# EAGLE design plug-v24-Make-board-myself-to-test-circuit (EAGLE 7.6.0)
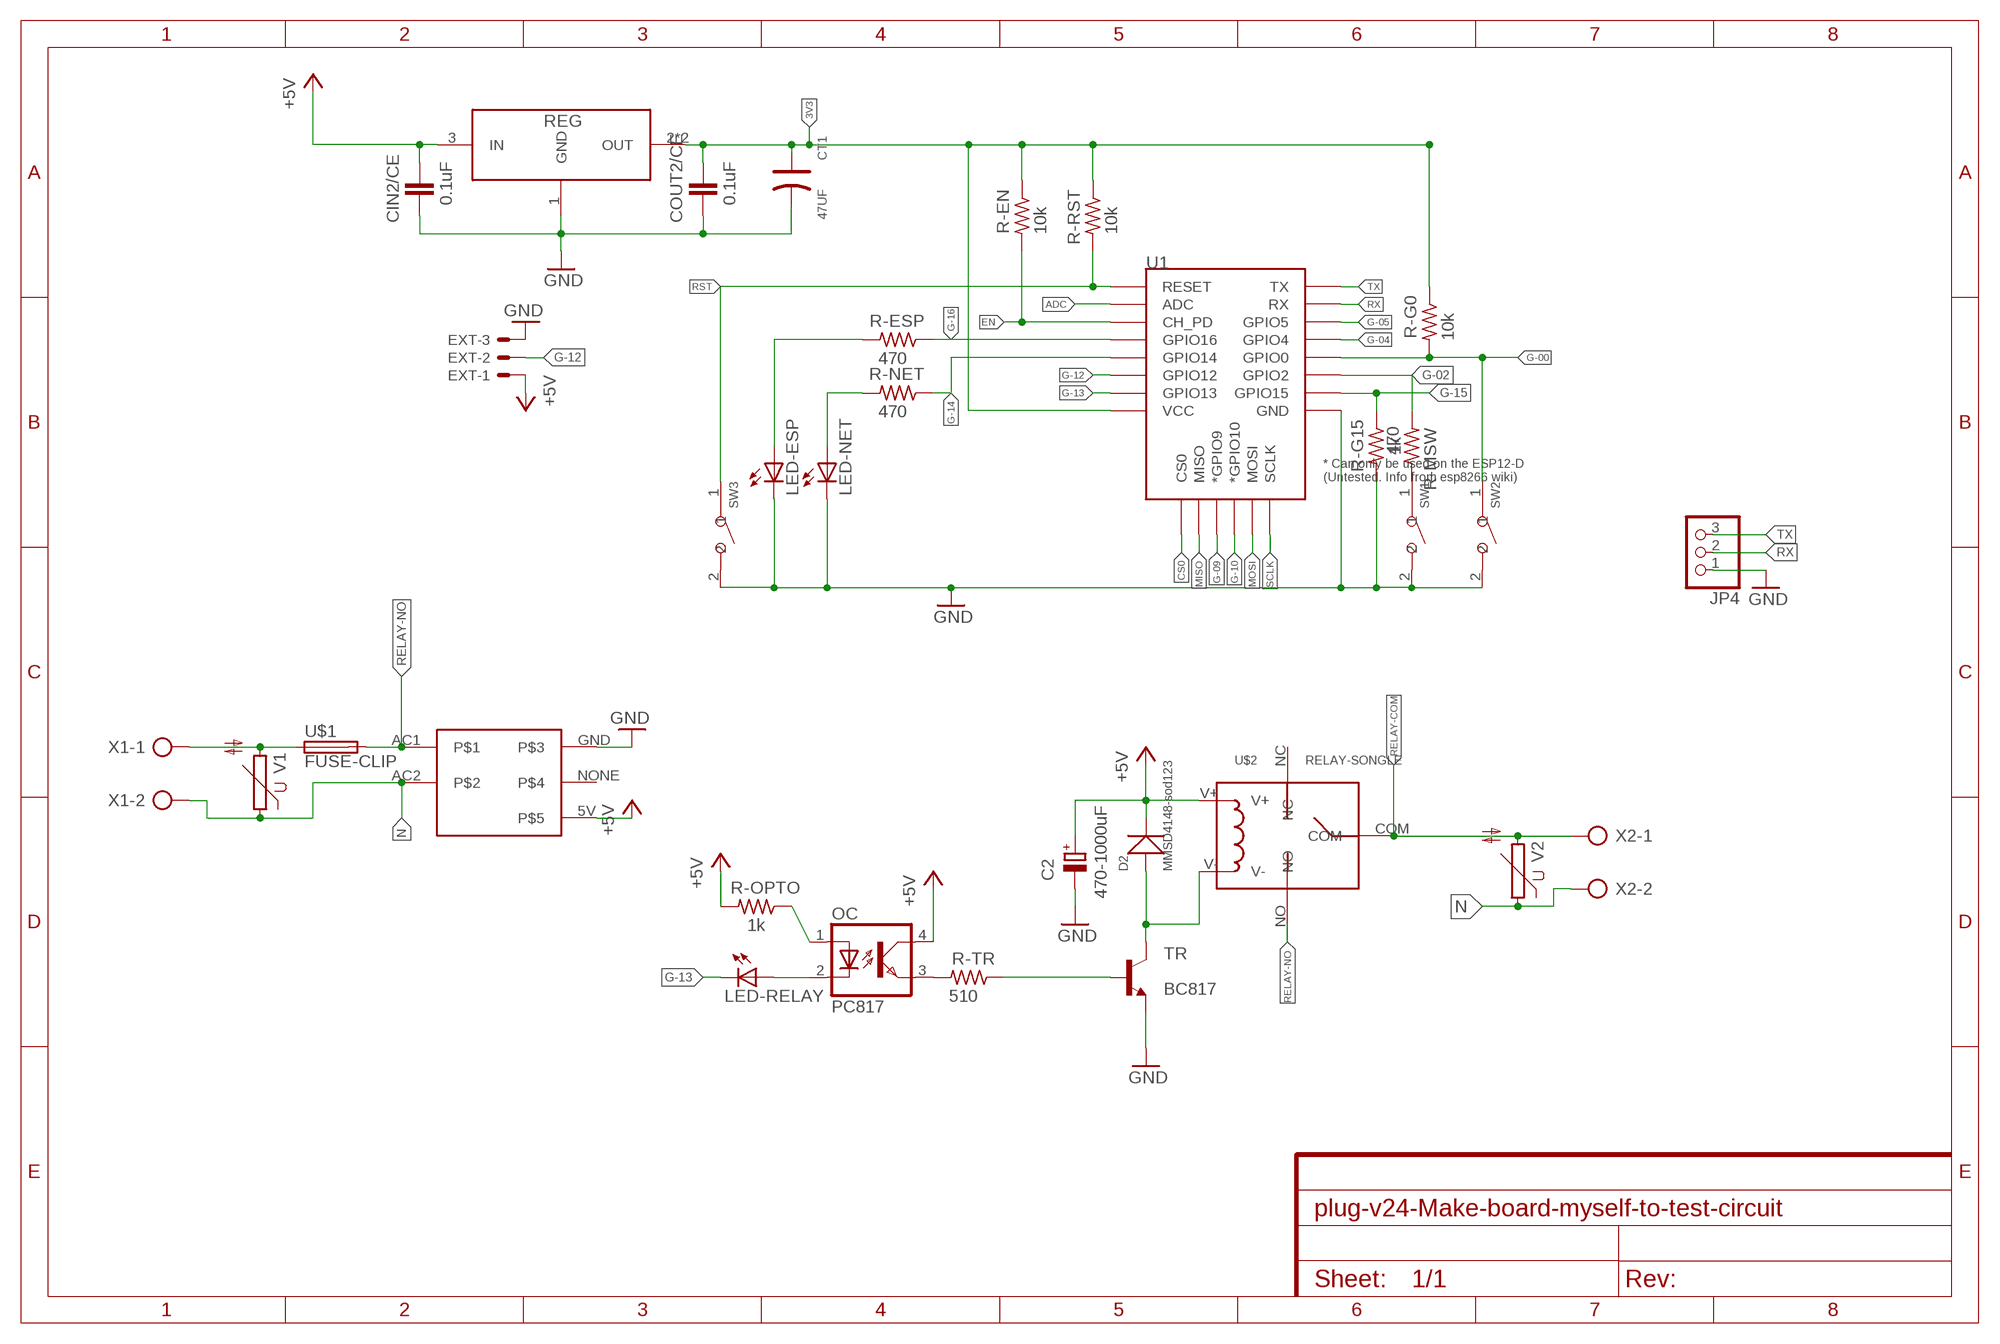
[diagram p0: schematic, sheet 1]

## Parts
C2  470-1000uF  CPOL-EUE3.5-8  [E3,5-8]
CIN2/CE  0.1uF  C-EUC0805K  [C0805K]
COUT2/CE  0.1uF  C-EUC0805K  [C0805K]
CT1  47UF  ALUMINUM-SMD-47UF-25V(D6.3-H5.3MM)  [ELECTRO-SMD-C-6MM]
D2  MMSD4148-sod123  SMD-DIODE-100V-200MA(SOD-123)  [SOD-123]
EXT  53048-03  [53048-03]
JP4  PINHD-1X3  [1X03]
LED-ESP  LEDCHIPLED_0805  [CHIPLED_0805]
LED-NET  LEDCHIPLED_0805  [CHIPLED_0805]
LED-RELAY  LEDCHIPLED_0805  [CHIPLED_0805]
OC  PC817  [DIL04]
R-EN  10k  R-US_M0805  [M0805]
R-ESP  470  R-US_M0805  [M0805]
R-G0  10k  R-US_M0805  [M0805]
R-G15  1k  R-US_M0805  [M0805]
R-MSW  470  R-US_M0805  [M0805]
R-NET  470  R-US_M0805  [M0805]
R-OPTO  1k  R-US_M0805  [M0805]
R-RST  10k  R-US_M0805  [M0805]
R-TR  510  R-US_M0805  [M0805]
REG  AMS1117-3.3  [SOT-223]
SW1  DIP-BUTTON(2P-6.0X3.0X4.3MM)-TS-1101F  [SW2-5.0-6.0X3.0X4.3MM]
SW2  DIP-BUTTON(2P-6.0X3.0X4.3MM)-TS-1101F  [SW2-5.0-6.0X3.0X4.3MM]
SW3  DIP-BUTTON(2P-6.0X3.0X4.3MM)-TS-1101F  [SW2-5.0-6.0X3.0X4.3MM]
TR  BC817  BC817-16SMD  [SOT23-BEC]
U1  ESP12ESMD  [ESP12E-SMD]
U$1  FUSE-CLIP  [FUSE-CLIP]
U$2  RELAY-SONGLE  [RELAY-SONGLE]
U$4  POWERSUPPLY-5V-700MA  [POWERSUPPLY-5V-700MA]
V1  S14K11  [S14K11]
V2  S14K11  [S14K11]
X1  AK300/2  [AK300/2]
X2  AK300/2  [AK300/2]

## Nets
3V3: COUT2/CE.1 CT1.+ R-EN.1 R-G0.1 R-RST.1 REG.2(OUT) REG.4(OUT) U1.VCC
+5V: C2.+ CIN2/CE.1 D2.- EXT.1 OC.4(COL) R-OPTO.2 REG.3(IN) U$2.V+ U$4.5V
ADC: U1.ADC
CS0: U1.CS0
EN: R-EN.2 U1.CH_PD
G-00: R-G0.2 SW2.1 U1.GPIO0
G-02: R-MSW.2 U1.GPIO2
G-04: U1.GPIO4
G-05: U1.GPIO5
G-09: U1.GPIO9(*GPIO9)
G-10: U1.GPIO10(*GPIO10)
G-12: EXT.2 U1.GPIO12
G-13: LED-RELAY.C U1.GPIO13
G-14: R-NET.1 U1.GPIO14
G-15: R-G15.1 U1.GPIO15
G-16: R-ESP.1 U1.GPIO16
GND: C2.- CIN2/CE.2 COUT2/CE.2 CT1.- EXT.3 JP4.1 LED-ESP.C LED-NET.C R-G15.2 REG.1(GND) SW1.2 SW2.2 SW3.2 TR.E U1.GND U$4.GND
LINE: U$1.3 U$1.4 V1.2 X1.1
MISO: U1.MISO
MOSI: U1.MOSI
N: U$4.AC2 V1.1 V2.1 X1.2 X2.2
N$1: OC.3(EMIT) R-TR.2
N$2: R-TR.1 TR.B
N$6: LED-ESP.A R-ESP.2
N$13: OC.1(A) R-OPTO.1
N$16: LED-NET.A R-NET.2
N$17: D2.+ TR.C U$2.V-
N$21: LED-RELAY.A OC.2(C)
N$22: R-MSW.1 SW1.1
RELAY-COM: U$2.COM V2.2 X2.1
RELAY-NO: U$1.5 U$1.6 U$2.NO U$4.AC1
RST: R-RST.2 SW3.1 U1.RESET
RX: JP4.2 U1.RXD0(RX)
SCLK: U1.SCLK
TX: JP4.3 U1.TXD0(TX)
Unconnected: U$2.NC U$4.NONE

## Library data of the parts
C2 = rcl:CPOL-EU: POLARIZED CAPACITOR, European symbol
CIN2/CE COUT2/CE = rcl:C-EU: CAPACITOR, European symbol
CT1 = Seeed-OPL-Capacitor:ALUMINUM-SMD-47UF-25V(D6.3-H5.3MM): 302030059; MPN: CS1E470M-CRE54
D2 = Seeed-OPL-Diode:SMD-DIODE-100V-200MA(SOD-123): 304010007; MPN: MMSD4148
EXT = con-molex:53?-03: CONNECTOR wire to board 1.25 mm (.049 inch) pitch header; MF: WALDOM/MOLEX; MPN: 53048-0310; OC_FARNELL: 9732918; OC_NEWARK: 38C9908
JP4 = pinhead:PINHD-1X3: PIN HEADER
LED-ESP LED-NET LED-RELAY = led:LED: LED OSRAM: - CHIPLED LG R971, LG N971, LY N971, LG Q971, LY Q971, LO R971, LY R971 LH N974, LH R974 LS Q976, LO Q976, LY Q976 LO Q996 - Hyper CHIPLED LW Q18S LB Q993, LB Q99A, LB R99A - SideLED LS A670, LO A670, LY A670, LG A670, LP A670 LB A673, LV A673, LT A673, LW A673 LH A674 LY A675 LS A676, LA A676, LO A676, LY A676, LW A676 LS A679, LY A679, LG A679 - Hyper Micro SIDELED® LS Y876, LA Y876, LO Y876, LY Y876 LT Y87S - SmartLED LW L88C, LW L88S LB L89C, LB L89S, LG L890 LS L89K, LO L89K, LY L89K LS L896, LA L896, LO L896, LY L896 - TOPLED LS T670, LO T670, LY T670, LG T670, LP T670 LSG T670, LSP T670, LSY T670, LOP T670, LYG T670 LG T671, LOG T671, LSG T671 LB T673, LV T673, LT T673, LW T673 LH T674 LS T676, LA T676, LO T676, LY T676, LB T676, LH T676, LSB T676, LW T676 LB T67C, LV T67C, LT T67C, LS T67K, LO T67K, LY T67K, LW E67C LS E67B, LA E67B, LO E67B, LY E67B, LB E67C, LV E67C, LT E67C LW T67C LS T679, LY T679, LG T679 LS T770, LO T770, LY T770, LG T770, LP T770 LB T773, LV T773, LT T773, LW T773 LH T774 LS E675, LA E675, LY E675, LS T675 LS T776, LA T776, LO T776, LY T776, LB T776 LHGB T686 LT T68C, LB T68C - Hyper Mini TOPLED® LB M676 - Mini TOPLED Santana® LG M470 LS M47K, LO M47K, LY M47K Source: http://www.osram.convergy.de LUXEON: - LUMILED® LXK2-PW12-R00, LXK2-PW12-S00, LXK2-PW14-U00, LXK2-PW14-V00 LXK2-PM12-R00, LXK2-PM12-S00, LXK2-PM14-U00 LXK2-PE12-Q00, LXK2-PE12-R00, LXK2-PE12-S00, LXK2-PE14-T00, LXK2-PE14-U00 LXK2-PB12-K00, LXK2-PB12-L00, LXK2-PB12-M00, LXK2-PB14-N00, LXK2-PB14-P00, LXK2-PB14-Q00 LXK2-PR12-L00, LXK2-PR12-M00, LXK2-PR14-Q00, LXK2-PR14-R00 LXK2-PD12-Q00, LXK2-PD12-R00, LXK2-PD12-S00 LXK2-PH12-R00, LXK2-PH12-S00 LXK2-PL12-P00, LXK2-PL12-Q00, LXK2-PL12-R00 Source: www.luxeon.com KINGBRIGHT: KA-3528ASYC Source: www.kingbright.com
OC = optocoupler:PC817: SHARP OPTO COUPLER; MPN: PC817X4J000F; OC_FARNELL: 9707727; OC_NEWARK: 97K7059
R-EN R-ESP R-G0 R-G15 R-MSW R-NET R-OPTO R-RST R-TR = rcl:R-US_: RESISTOR, American symbol
REG = AMS1117-3.3:AMS1117-3.3: 1A LOW DROPOUT VOLTAGE REGULATOR
SW1-SW3 = Seeed-OPL-Switch:DIP-BUTTON(2P-6.0X3.0X4.3MM): 311020025
TR = transistor-npn:BC817*: NPN Transistor
U1 = esp8266modules:ESP12E: ESP12E Module
U$1 = Fuse-Clip:FUSE-CLIP
U$2 = Relay-Songle:RELAY-SONGLE
U$4 = PowerSupply-5V-700mA:POWERSUPPLY-5V-700MA
V1 V2 = varistor:S14K11: VARISTOR
X1 X2 = con-ptr500:AK300/2: CONNECTOR; OC_FARNELL: unknown; OC_NEWARK: unknown

## Board
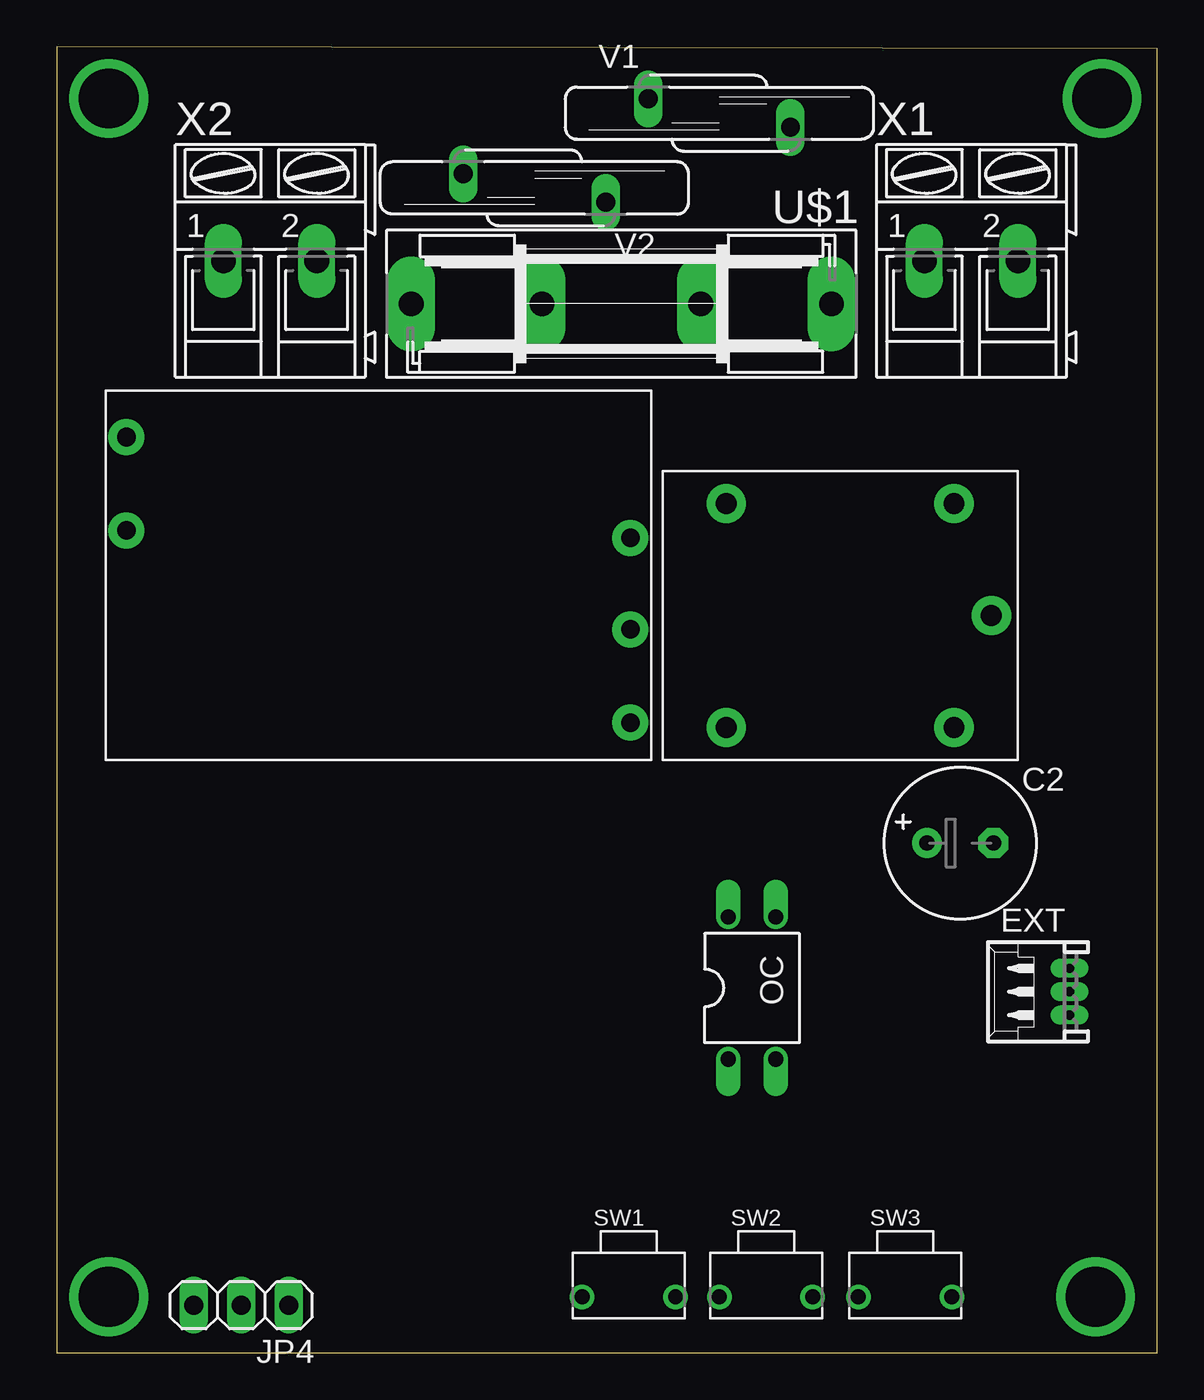
[diagram p1: board, top side]
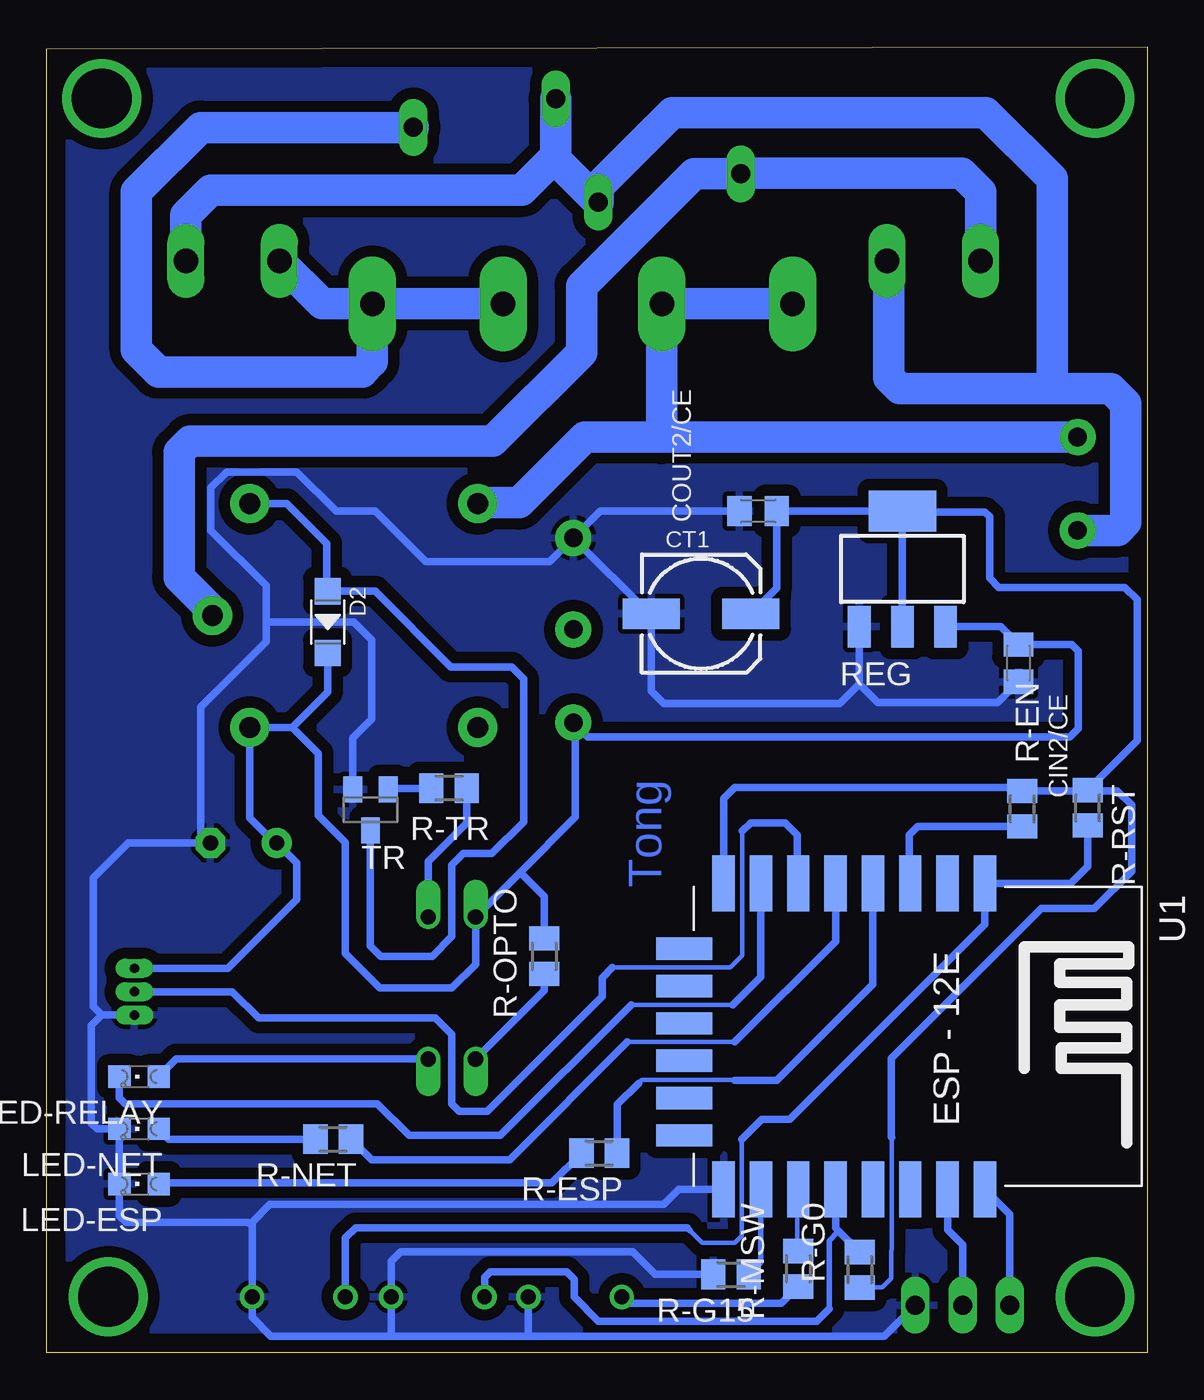
[diagram p2: board, bottom side, seen from below]

Size 58.95 x 69.98 mm. Coordinates in mm from the lower left corner, seen from the top.
Outline: 0,0 58.95,0 58.95,69.88 0,69.98 0,0
Copper layers (1*16): Top 0.035mm / dielectric 1.5mm / Bottom 0.035mm
Design rules "default": minimum track width 10mil, minimum drill 24mil, track to track 8mil, track to pad 8mil, pad to pad 8mil, via to via 8mil, smd to smd 8mil, copper to edge 40mil, drill to drill 8mil, minimum pad ring 10mil, minimum via ring 8mil, stop-mask expansion 4mil, vias tented up to drill 0mil, thermal gap 10mil

### Footprints (pad centres in the part's own frame; a part is rotated, then mirrored left to right if it is on the bottom)
E3,5-8 = drill 0.813 pad 1.6: + -1.778,0 | drill 0.813 pad 1.6 octagon: - 1.778,0
C0805K = smd 1.3 x 1.6: 1 -1,0; 2 1,0
ELECTRO-SMD-C-6MM = smd 3.048 x 1.651: + 2.667,0; - -2.667,0
SOD-123 = smd 1.397 x 1.397: + -1.651,0; - 1.651,0
53048-03 = drill 0.5 pad 0.698 long: 1 1.25,-1.25; 2 0,-1.25; 3 -1.25,-1.25
1X03 = drill 1.016 long: 1 -2.54,0; 2 0,0; 3 2.54,0
CHIPLED_0805 = smd 1.2 x 1.2: A 0,-1.05; C 0,1.05
DIL04 = drill 0.813 offset: 1 -1.27,-3.81; 2 1.27,-3.81; 3 1.27,3.81; 4 -1.27,3.81
M0805 = smd 1.3 x 1.6: 1 -0.95,0; 2 0.95,0
SOT-223 = smd 1.219 x 2.235: 1 -2.381,-3.099; 2 -0.07,-3.099; 3 2.241,-3.099 | smd 3.6 x 2.2: 4 -0.07,3.099
SW2-5.0-6.0X3.0X4.3MM = drill 0.8 pad 1.27: 1 -2.5,0; 2 2.5,0
SOT23-BEC = smd 1 x 1.4: B -0.95,-1.1; C 0,1.1; E 0.95,-1.1
ESP12E-SMD = smd 3 x 1.2: ADC -8.3,3.8; CH_PD -8.3,1.8; GND 8.1,-8.2; GPIO0 8.1,-2.2; GPIO2 8.1,-4.2; GPIO4 8.1,-0.2; GPIO5 8.1,1.8; GPIO12 -8.3,-4.2; GPIO13 -8.3,-6.2; GPIO14 -8.3,-2.2; GPIO15 8.1,-6.2; GPIO16 -8.3,-0.2; RESET -8.3,5.8; RXD0 8.1,3.8; TXD0 8.1,5.8; VCC -8.3,-8.2 | smd 1.2 x 3: CS0 -4.8,-10.3; GPIO9 -0.8,-10.3; GPIO10 1.2,-10.3; MISO -2.8,-10.3; MOSI 3.2,-10.3; SCLK 5.2,-10.3
FUSE-CLIP = drill 1.321 pad 2.54 long: 1 -11.252,0; 2 11.252,0; 3 -11.252,0; 4 -4.252,0; 5 11.252,0; 6 4.252,0
RELAY-SONGLE = drill 1.118 pad 2.1: COM -8.1,0; NC 6.1,6; NO 6.1,-6; V+ -6.1,6; V- -6.1,-6
POWERSUPPLY-5V-700MA = drill 1 pad 1.93: 5V 13.5,-7.9; AC1 -13.5,7.4; AC2 -13.5,2.4; GND 13.5,2; NONE 13.5,-2.9
S14K11 = drill 1.016 long: 1 -0.762,-3.81; 2 0.762,3.81
AK300/2 = drill 1.321 long: 1 -2.515,0; 2 2.489,0

### Placement (x,y rotation side)
C2  48.4,27.31 0 top
CIN2/CE  6.9,36.95 270 bottom
COUT2/CE  20.85,45.1 180 bottom
CT1  23.9,39.6 0 bottom
D2  43.9,39.15 270 bottom
EXT  53,19.35 90 top
JP4  9.9,2.55 180 top
LED-ESP  54,9.05 90 bottom
LED-NET  54,12 90 bottom
LED-RELAY  54,14.8 90 bottom
OC  37.25,19.55 0 top
R-EN  6.7,29.15 270 bottom
R-ESP  29.35,10.7 180 bottom
R-G0  15.4,4.45 90 bottom
R-G15  22.3,4.2 180 bottom
R-MSW  18.7,4.5 90 bottom
R-NET  43.6,11.45 180 bottom
R-OPTO  32.3,21.25 90 bottom
R-RST  3.2,29.2 270 bottom
R-TR  37.4,30.25 0 bottom
REG  13.05,42 0 bottom
SW1  30.65,3 0 top
SW2  38,3 0 top
SW3  45.45,3 0 top
TR  41.61,29.09 180 bottom
U1  14.5,16.85 270 bottom
U$1  30.25,56.2 180 top
U$2  41.97,39.5 180 top
U$4  17.24,41.66 0 top
V1  35.5,66.42 270 top
V2  25.6,62.41 90 top
X1  49,58.5 0 top
X2  11.45,58.5 0 top

### Tracks (layer width: path | path; a pad name or v marks a point on that pad's centre or on a via)
3V3
  Bottom 0.254: R-RST.1 3.2,30.18 3.2,30.1 | 13.7,11.55 13.7,5.52 13.72,5.5 13.72,3.98 14.2,3.5 R-G0.1
  Bottom 0.406: U1.VCC 22.7,29.7 22.1,30.3 6.9,30.3 | R-EN.1 3.2,30.1 1.6,30.1 0.85,29.35 0.85,25.8 2.85,23.8 5.69,23.8 13.72,15.77 13.72,11.57 13.7,11.55 | R-RST.1 0.55,32.8 0.55,40.35 1.2,41 7.95,41 8.45,41.5 8.45,44.8 8.7,45.05 13.07,45.05 | REG.2 REG.4 COUT2/CE.1 19.85,40.98 CT1.+
  Bottom 0.61: 6.9,30.3 R-EN.1 | 13.07,45.05 REG.4
+5V
  Bottom 0.254: 30.63,33.6 U$4.5V
  Bottom 0.406: 30.63,33.6 30.63,28.71 33.59,25.75 | 33.59,25.75 OC.4 35.98,20.82 37.25,19.55 41.1,19.55 42.95,21.4 42.95,27.35 44.4,28.8 44.4,32.1 45.8,33.5 | D2.- 43.9,35.4 45.8,33.5 | 45.8,33.5 U$2.V+ 48.07,28.66 46.72,27.31 C2.+ 45.55,26.24 45.55,24.3 49.25,20.6 EXT.1 | U$4.5V 29.98,33 4.15,33 3.7,33.45 3.7,37.6 4.05,37.95 CIN2/CE.1 7.85,38.9 REG.3 | R-OPTO.2 32.3,24.45 33.59,25.75
  Bottom 0.61: CIN2/CE.1
EN
  Bottom 0.406: R-EN.2 12.3,28.2 12.75,27.75 12.75,25.2
  Bottom 0.61: 12.75,25.2 U1.CH_PD
G-00
  Bottom 0.305: 17.05,2.35 17.05,6 16.57,6.47 16.57,6.58
  Bottom 0.406: R-G0.2 16.57,6.58 16.7,6.7 U1.GPIO0 | 17.05,2.35 17.7,1.7 29.4,1.7 30.7,3 30.7,3.95 31.1,4.35 35.2,4.35 35.5,4.05 SW2.1
  Bottom 0.61: 16.6,8.65 U1.GPIO0
G-02
  Bottom 0.254: R-MSW.2 18.75,5.49 18.75,8.69 U1.GPIO2
G-12
  Bottom 0.254: 18.75,27.7 18.75,27.75 | 21.7,27.95 21.7,21.3 22.35,20.65 28.65,20.65 | 18.75,25.2 U1.GPIO12
  Bottom 0.406: 18.75,27.75 19.4,28.4 21.25,28.4 21.7,27.95 | 28.65,20.65 29.2,20.1 29.2,19.1 35.35,12.95 36.85,12.95 37.25,13.35 37.25,17.05 38.15,17.95 47.6,17.95 49,19.35 EXT.2 | 18.75,27.7 18.75,25.2
G-13
  Bottom 0.254: 22.2,18.65 27.65,18.65
  Bottom 0.406: U1.GPIO13 20.7,20.15 22.2,18.65 | 27.65,18.65 34.65,11.65 39.54,11.65 41.24,13.35 54.75,13.35 55.05,13.65 LED-RELAY.C
G-14
  Bottom 0.254: 22.1,16.65 27.85,16.65
  Bottom 0.406: U1.GPIO14 16.7,22.05 22.1,16.65 | 27.85,16.65 34.15,10.35 41.55,10.35 R-NET.1
G-15
  Bottom 0.305: U1.GPIO15 20.7,4.85 R-G15.1
G-16
  Bottom 0.254: 22.1,14.6 22.13,14.63 27.07,14.63 27.25,14.45
  Bottom 0.406: U1.GPIO16 14.7,19.75 19.85,14.6 22.1,14.6 | 27.25,14.45 28.4,13.3 R-ESP.1
GND
  Bottom 0.406: 47.2,39.15 42.5,39.15 41.55,38.2 41.55,33.95 42.55,32.95 TR.E | 47.2,39.15 47.2,41.1 50.15,44.05 50.15,46.35 49.3,47.2 45.55,47.2 43.45,45.1 41.35,45.1 38.65,42.4 32,42.4 U$4.GND | 47.2,39.15 47.2,38.1 50.7,34.6 50.7,27.83 C2.- 54.59,27.31 56.45,25.45 56.45,18.55 56,18.1 | 47.95,6.8 47.95,7 47,7.95 25.9,7.95 25.1,8.75 U1.GND | 47.95,6.8 SW3.2 47.95,1.9 46.95,0.9 40.65,0.9 | CIN2/CE.2 8,34.85 14.45,34.85 15.43,35.83 | 15.43,35.83 REG.1 | 15.43,35.83 16.46,34.8 25.9,34.8 26.57,35.47 CT1.- 26.68,39.6 U$4.GND | 56,18.1 EXT.3 | 56,18.1 56.55,17.55 56.55,12.3 56.25,12 LED-NET.C LED-ESP.C 55.05,7.35 54.7,7 48.15,7 47.95,6.8 | COUT2/CE.2 29.3,45.1 U$4.GND | JP4.1 14.09,0.9 33.2,0.9 | 33.2,0.9 40.65,0.9 | SW1.2 33.15,0.95 33.2,0.9 | R-G15.2 26.35,4.2 27.55,5.4 40,5.4 40.5,4.9 SW2.2 40.5,1.05 40.65,0.9
  pour Bottom (isolate 0.61): 0,0 59,0 59,70 0,70
LINE
  Bottom 1.676: U$1.3 41.5,53.1 42.05,52.55 52.95,52.55 54.15,53.75 54.15,62.2 50.7,65.65 V1.2 | U$1.3 44.19,56.2 X1.1 | U$1.4 U$1.3
N
  Bottom 1.676: U$4.AC2 1.59,44.06 1.15,44.5 1.15,50.85 1.95,51.65 5.1,51.65 | 5.1,51.65 13.25,51.65 13.85,52.25 13.85,58.41 X2.2 | 5.1,51.65 5.1,62.9 8.65,66.45 25.45,66.45 29.41,62.49 V2.1 31.69,63.93 | V1.1 31.69,63.93 | X1.2 51.49,60.96 50.15,62.3 33.5,62.3 31.87,63.93 31.69,63.93
N$1
  Bottom 0.406: OC.3 38.52,26.33 36.45,28.4 R-TR.2
N$2
  Bottom 0.406: R-TR.1 40.6,30.25 TR.B
N$3  (via drill 3.2)
  other vias: 2.8,67.2
N$4  (via drill 3.2)
  other vias: 2.8,3
N$5  (via drill 3.2)
  other vias: 55.65,3
N$6
  Bottom 0.406: R-ESP.2 31.9,9.1 52.9,9.1 LED-ESP.A
N$7  (via drill 3.2)
  other vias: 56,67.2
N$13
  Bottom 0.406: OC.1 32.3,19.42 R-OPTO.1
N$16
  Bottom 0.406: R-NET.2 52.4,11.45 LED-NET.A
N$17
  Bottom 0.406: D2.+ 41.35,40.8 37.3,36.75 34.05,36.75 33.4,36.1 33.4,28.45 35.1,26.75 36.65,26.75 37.25,26.15 37.25,22.3 38.3,21.25 41.05,21.25 41.61,21.81 TR.C | U$2.V- 46.1,45.5 43.95,43.35 43.95,40.85
  Bottom 0.61: 43.95,40.85 D2.+
N$21
  Bottom 0.406: OC.2 52.01,15.74 LED-RELAY.A
N$22
  Bottom 0.406: R-MSW.1 19.6,2.65 27.8,2.65 SW1.1
RELAY-COM
  Bottom 1.676: X2.1 8.94,62.19 9.95,63.2 21.76,63.2 V2.2 24.28,63.17 30.3,57.15 30.3,53.6 35.05,48.85 51.25,48.85 51.85,48.25 51.85,41.55 50.07,39.77 U$2.COM
RELAY-NO
  Bottom 1.676: U$4.AC1 26.05,49.06 | 26.05,49.06 30.14,49.06 33.65,45.55 35.82,45.55 U$2.NO | U$1.5 U$1.6 26,49.11 26.05,49.06
RST
  Bottom 0.254: 21.72,11.43 21.72,6.28 22.1,5.9 23.85,5.9 24.48,6.53 24.47,6.55
  Bottom 0.305: 24.48,6.53 24.65,6.7
  Bottom 0.406: R-RST.2 3.2,26.05 4.1,25.15 U1.RESET 8.7,22.95 19.15,12.5 20.65,12.5 21.72,11.43 | SW3.1 42.95,6.15 42.4,6.7 24.65,6.7
RX
  Bottom 0.406: JP4.2 9.9,5.8 10.7,6.6 U1.RXD0
TX
  Bottom 0.406: U1.TXD0 7.36,7.41 JP4.3

### Text on the board
Bottom: Tong